# EAGLE design femto-beacon-esp32-lps (EAGLE 9.3.0)

## Sheet 1 of 4
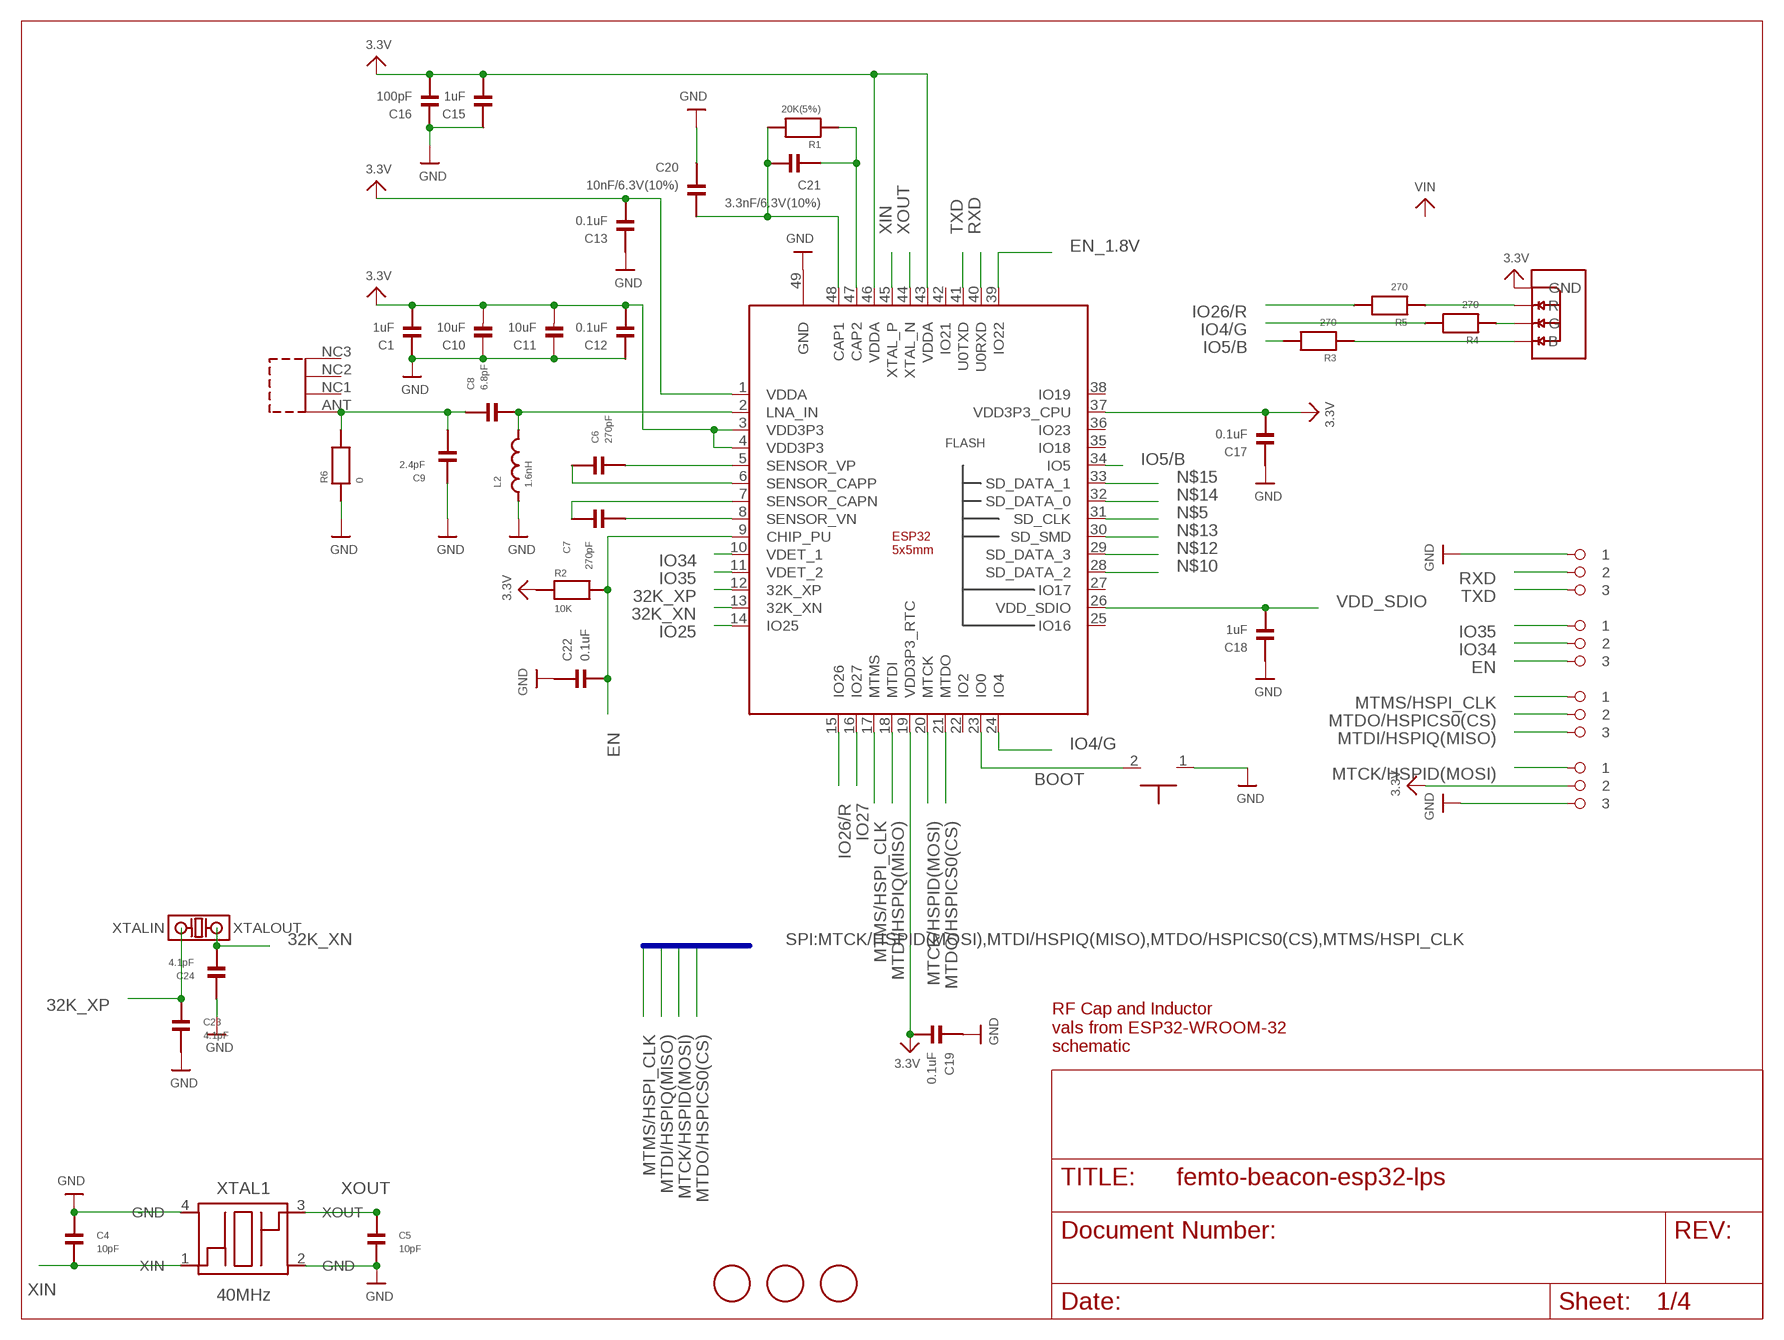
[diagram p0: schematic, sheet 1]

### Parts
ANT1  0479480001  [0479480001]
BOOT1  TACTILE_SWITCH_NO_GND_NO_BOSS  [SIDE_ACT_NO_GND_NO_BOSS]
C1  1uF  CAPACITOR_0201  [PART]
C4  10pF  CAPACITOR_0201  [PART]
C5  10pF  CAPACITOR_0201  [PART]
C6  270pF  CAPACITOR_0201  [PART]
C7  270pF  CAPACITOR_0201  [PART]
C8  6.8pF  CAPACITOR_0201  [PART]
C9  2.4pF  CAPACITOR_0201  [PART]
C10  10uF  CAP_CERAMIC_0603MP  [_0603MP]
C11  10uF  CAP_CERAMIC_0603MP  [_0603MP]
C12  0.1uF  CAPACITOR_0201  [PART]
C13  0.1uF  CAPACITOR_0201  [PART]
C15  1uF  CAPACITOR_0201  [PART]
C16  100pF  CAPACITOR_0201  [PART]
C17  0.1uF  CAPACITOR_0201  [PART]
C18  1uF  CAPACITOR_0201  [PART]
C19  0.1uF  CAPACITOR_0201  [PART]
C20  10nF/6.3V(10%)  CAPACITOR_0201  [PART]
C21  3.3nF/6.3V(10%)  CAPACITOR_0201  [PART]
C22  0.1uF  CAPACITOR_0201  [PART]
C23  4.1pF  CAPACITOR_0201  [PART]
C24  4.1pF  CAPACITOR_0201  [PART]
FID1  FIDUCIAL  [FIDUCIAL_1MM]
FID2  FIDUCIAL  [FIDUCIAL_1MM]
FID3  FIDUCIAL  [FIDUCIAL_1MM]
IC1  ESP32-QFN_5X5  [ESP32-QFN48_5X5]
L2  1.6nH  INDUCTOR_FIXED_0201  [PART]
PIN_EN  1X3_ROUND  [1X3_ROUND]
PIN_GPIO_A  1X3_ROUND  [1X3_ROUND]
PIN_GPIO_B  1X3_ROUND  [1X3_ROUND]
PIN_UART  1X3_ROUND  [1X3_ROUND]
R1  20K(5%)  RESISTOR_0201  [PART]
R2  10K  RESISTOR_0201  [PART]
R3  270  RESISTOR_0201  [PART]
R4  270  RESISTOR_0201  [PART]
R5  270  RESISTOR_0201  [PART]
R6  0  RESISTOR_0201  [PART]
RGB1  LRTB_R48G  [LRTB_R48G]
XTAL1  40MHz  FA-128  [FA-128]
XTAL2  ABS06-107-32.768KHZ-T  [ABS06-107-32.768KHZ-T]

### Nets
3.3V: C1.2 C10.2 C11.2 C12.2 C13.2 C15.2 C16.2 C17.2 C19.2 IC1.1(VDDA) IC1.3(VDD3P3) IC1.4(VDD3P3) IC1.19(VDD3P3_RTC) IC1.37(VDD3P3_CPU) IC1.43(VDDA) IC1.46(VDDA) PIN_GPIO_A.P$2 R2.1 RGB1.1(GND) ; also sheet 2,3,4
32K_XN: C24.1 IC1.13(32K_XN) XTAL2.2(XTALOUT)
32K_XP: C23.2 IC1.12(32K_XP) XTAL2.1(XTALIN)
ANT: C8.2 IC1.2(LNA_IN) L2.2
B_: R3.1 RGB1.4(B)
BOOT: BOOT1.2 IC1.23(IO0)
EN: C22.2 IC1.9(CHIP_PU) PIN_EN.P$3 R2.2
EN_1.8V: IC1.39(IO22)
G_: R4.1 RGB1.3(G)
GND: BOOT1.1 C1.1 C4.1 C5.1 C9.1 C10.1 C11.1 C12.1 C13.1 C15.1 C16.1 C17.1 C18.1 C19.1 C20.1 C22.1 C23.1 C24.2 IC1.49(GND) L2.1 PIN_GPIO_A.P$3 PIN_UART.P$1 R6.1 XTAL1.2(GND) XTAL1.4(GND) ; also sheet 2,3,4
IO4/G: IC1.24(IO4) R4.2
IO5/B: IC1.34(IO5) R3.2
IO25: IC1.14(IO25)
IO26/R: IC1.15(IO26) R5.2
IO27: IC1.16(IO27)
IO34: IC1.10(VDET_1) PIN_EN.P$2
IO35: IC1.11(VDET_2) PIN_EN.P$1
MTCK/HSPID(MOSI): IC1.20(MTCK) PIN_GPIO_A.P$1 ; also sheet 3,4
MTDI/HSPIQ(MISO): IC1.18(MTDI) PIN_GPIO_B.P$3 ; also sheet 3,4
MTDO/HSPICS0(CS): IC1.21(MTDO) PIN_GPIO_B.P$2 ; also sheet 3,4
MTMS/HSPI_CLK: IC1.17(MTMS) PIN_GPIO_B.P$1 ; also sheet 3,4
N$1: C6.1 IC1.5(SENSOR_VP)
N$2: C6.2 IC1.6(SENSOR_CAPP)
N$3: C7.2 IC1.8(SENSOR_VN)
N$4: C7.1 IC1.7(SENSOR_CAPN)
N$5: IC1.31(SD_CLK)
N$6: ANT1.ANT C8.1 C9.2 R6.2
N$7: C21.2 IC1.47(CAP2) R1.1
N$9: C20.2 C21.1 IC1.48(CAP1) R1.2
N$10: IC1.28(SD_DATA_2)
N$12: IC1.29(SD_DATA_3)
N$13: IC1.30(SD_SMD)
N$14: IC1.32(SD_DATA_0)
N$15: IC1.33(SD_DATA_1)
R_: R5.1 RGB1.2(R)
RXD: IC1.40(U0RXD) PIN_UART.P$2
TXD: IC1.41(U0TXD) PIN_UART.P$3
VDD_SDIO: C18.2 IC1.26(VDD_SDIO)
XIN: C4.2 IC1.45(XTAL_P) XTAL1.1(XIN)
XOUT: C5.2 IC1.44(XTAL_N) XTAL1.3(XOUT)
Unconnected: ANT1.NC1 ANT1.NC2 ANT1.NC3 IC1.22(IO2) IC1.25(IO16) IC1.27(IO17) IC1.35(IO18) IC1.36(IO23) IC1.38(IO19) IC1.42(IO21)

### Buses
SPI:MTCK/HSPID(MOSI),MTDI/HSPIQ(MISO),MTDO/HSPICS0(CS),MTMS/HSPI_CLK

### Notes on the sheet
- RF Cap and Inductor
  vals from ESP32-WROOM-32
  schematic

## Sheet 2 of 4
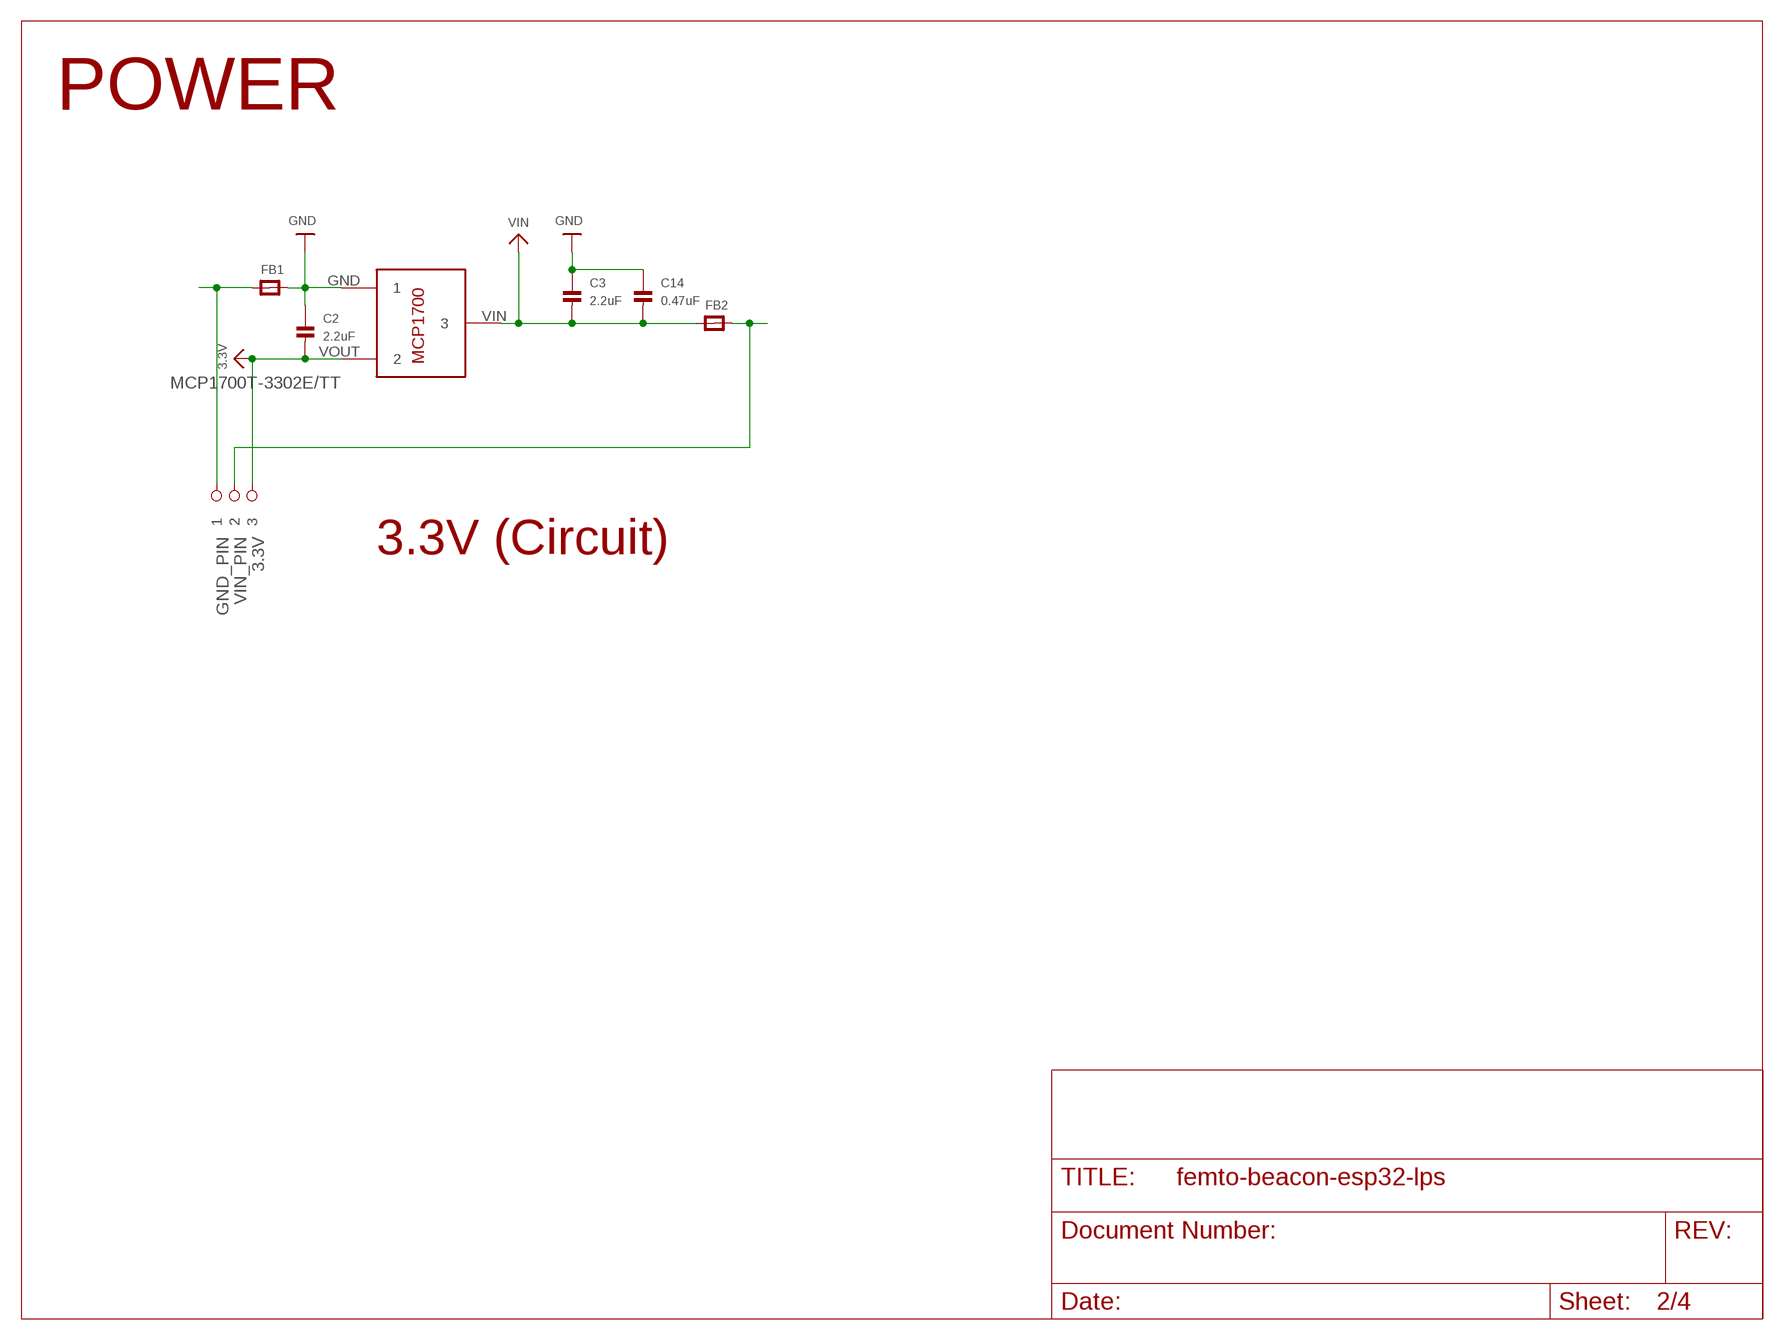
[diagram p1: schematic, sheet 2]

### Parts
C2  2.2uF  CAP_CERAMIC_0402MP  [_0402MP]
C3  2.2uF  CAP_CERAMIC_0402MP  [_0402MP]
C14  0.47uF  CAP_CERAMIC_0402MP  [_0402MP]
FB1  FERRITE_0603MP  [_0603MP]
FB2  FERRITE_0603MP  [_0603MP]
LDO1  MCP1700T-3302E/TT  [MCP1700T-3302E/TT]
PIN_PWR  1X3_ROUND  [1X3_ROUND]

### Nets
3.3V: C2.2 LDO1.VOUT PIN_PWR.P$3 ; also sheet 1,3,4
GND: C2.1 C3.1 C14.1 FB1.2 LDO1.GND ; also sheet 1,3,4
GND_PIN: FB1.1 PIN_PWR.P$1
VIN: C3.2 C14.2 FB2.1 LDO1.VIN
VIN_PIN: FB2.2 PIN_PWR.P$2

### Notes on the sheet
- POWER
- 3.3V (Circuit)

## Sheet 3 of 4
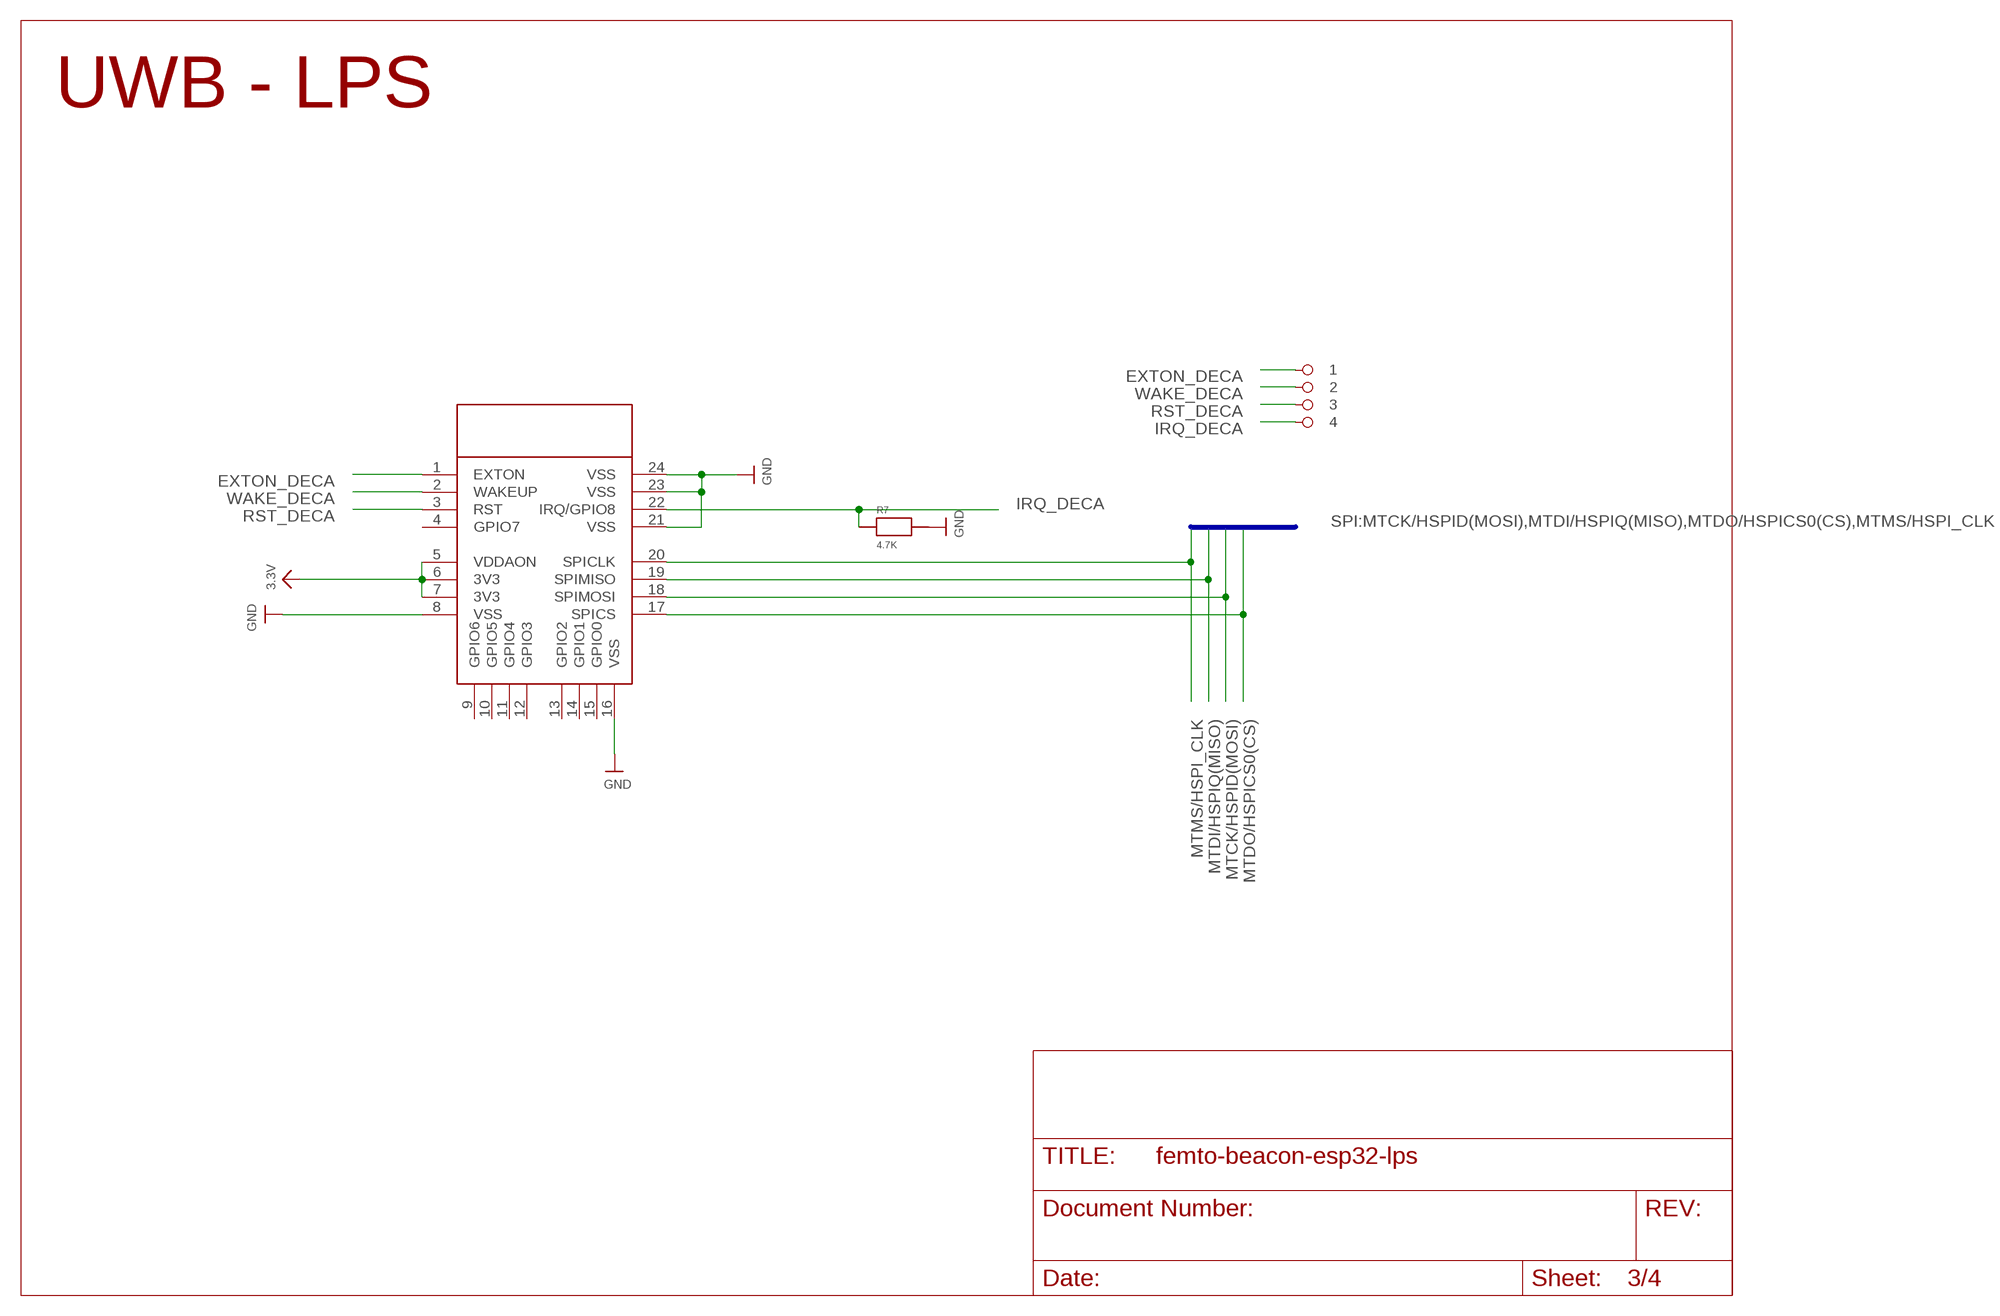
[diagram p2: schematic, sheet 3]

### Parts
LPS1  DWM100  [DWM100_MOD]
R7  4.7K  RESISTOR_0201  [PART]
U$39  1X4_ROUND  [1X4_ROUND]

### Nets
3.3V: LPS1.5(VDDAON) LPS1.6(3V3) LPS1.7(3V3) ; also sheet 1,2,4
EXTON_DECA: LPS1.1(EXTON) U$39.P$1
GND: LPS1.8(VSS) LPS1.16(VSS) LPS1.21(VSS) LPS1.23(VSS) LPS1.24(VSS) R7.2 ; also sheet 1,2,4
IRQ_DECA: LPS1.22(IRQ/GPIO8) R7.1 U$39.P$4
MTCK/HSPID(MOSI): LPS1.18(SPIMOSI) ; also sheet 1,4
MTDI/HSPIQ(MISO): LPS1.19(SPIMISO) ; also sheet 1,4
MTDO/HSPICS0(CS): LPS1.17(SPICS) ; also sheet 1,4
MTMS/HSPI_CLK: LPS1.20(SPICLK) ; also sheet 1,4
RST_DECA: LPS1.3(RST) U$39.P$3
WAKE_DECA: LPS1.2(WAKEUP) U$39.P$2
Unconnected: LPS1.4(GPIO7) LPS1.9(GPIO6) LPS1.10(GPIO5) LPS1.11(GPIO4) LPS1.12(GPIO3) LPS1.13(GPIO2) LPS1.14(GPIO1) LPS1.15(GPIO0)

### Buses
SPI:MTCK/HSPID(MOSI),MTDI/HSPIQ(MISO),MTDO/HSPICS0(CS),MTMS/HSPI_CLK

### Notes on the sheet
- UWB - LPS

## Sheet 4 of 4
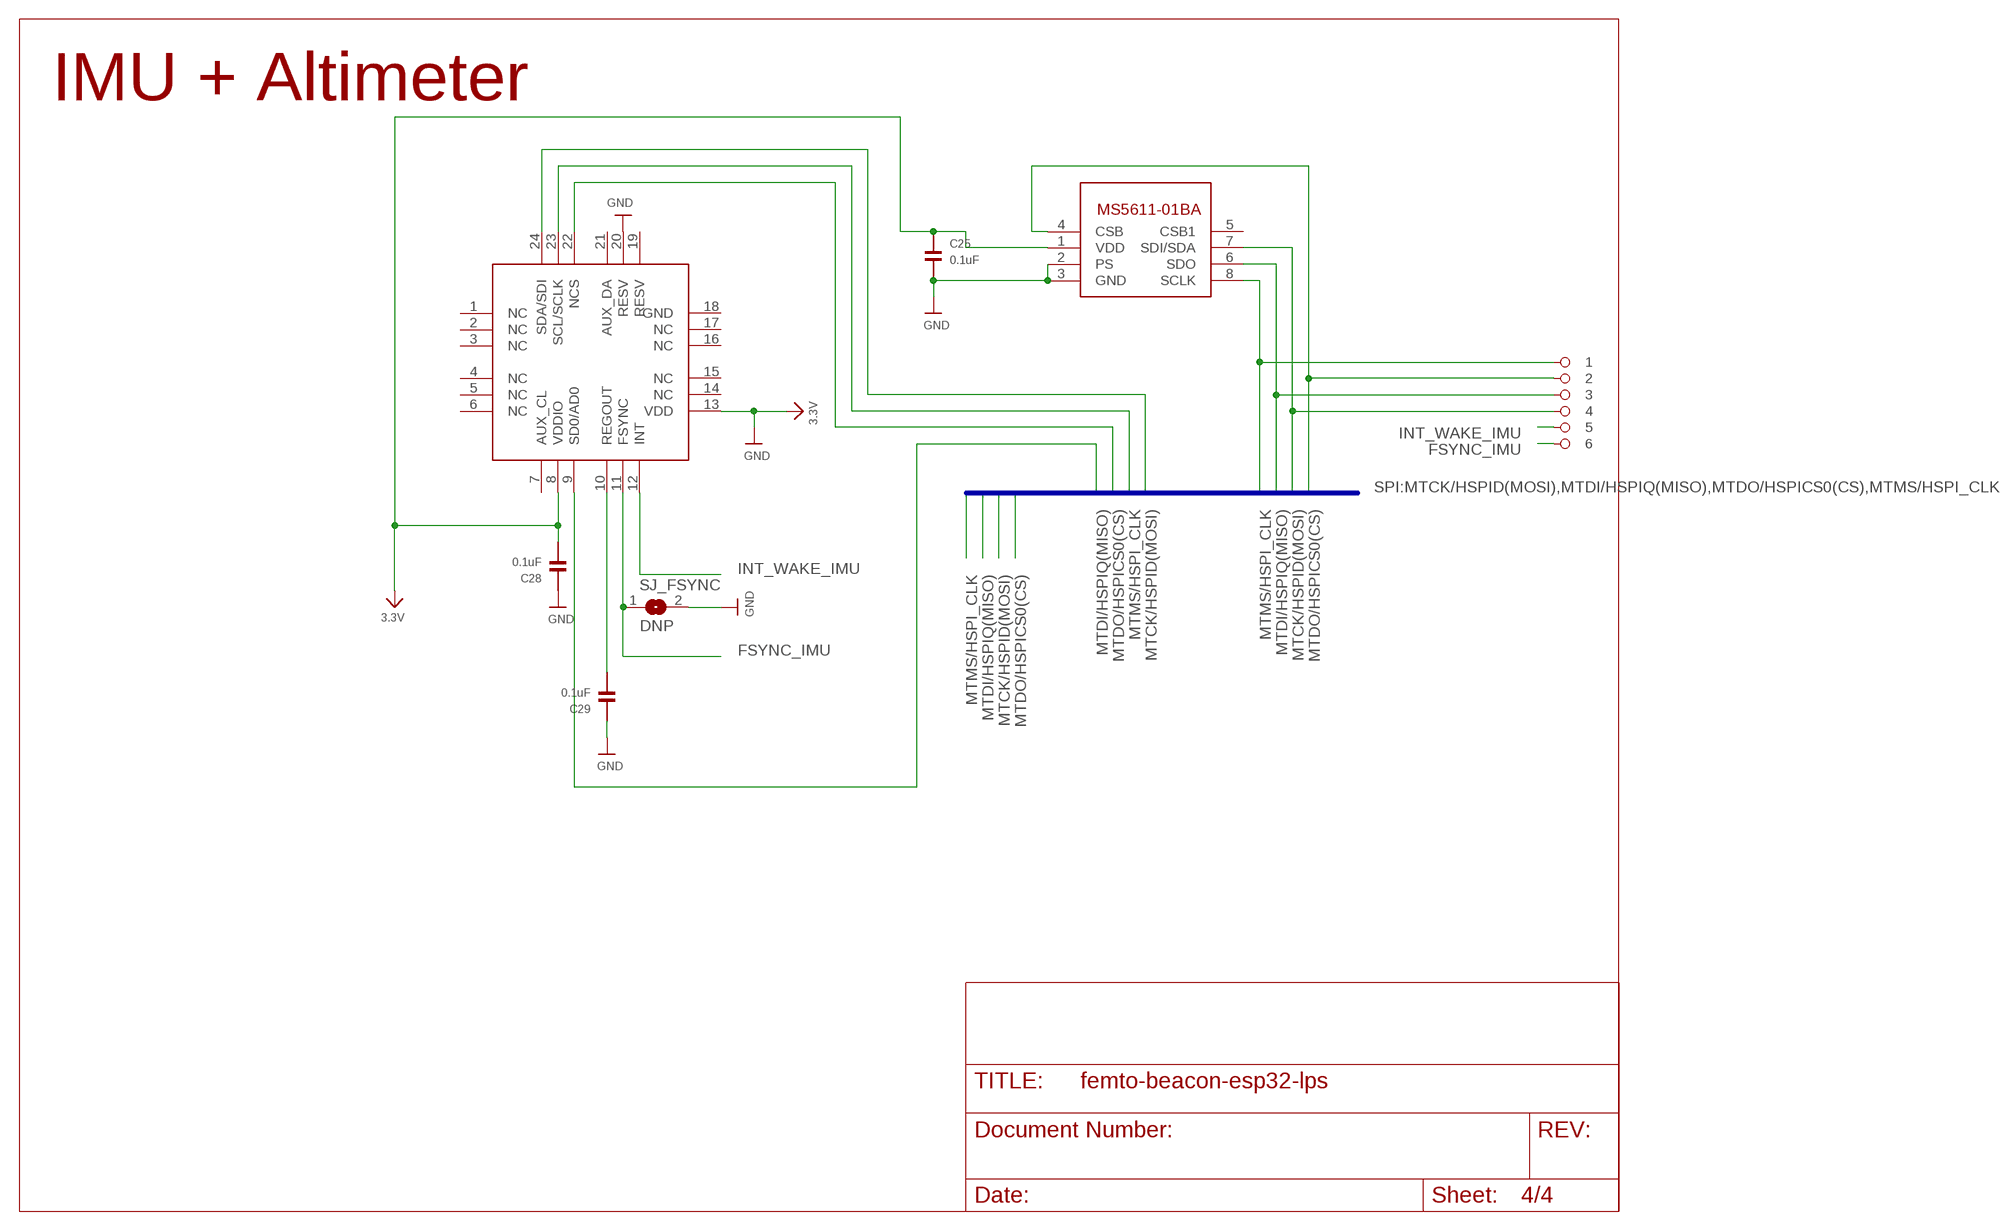
[diagram p3: schematic, sheet 4]

### Parts
ALT1  MS5611-01BA03  [MS5611-01BA03]
C25  0.1uF  CAPACITOR_0201  [PART]
C28  0.1uF  CAPACITOR_0201  [PART]
C29  0.1uF  CAPACITOR_0201  [PART]
IMU1  ICM-20948  [QFN24_3X3]
PIN_IMU_SPI  1X6_ROUND  [1X6_ROUND]
SJ_FSYNC  DNP  SOLDERJUMPERCLOSED  [SOLDERJUMPER_CLOSEDWIRE]

### Nets
3.3V: ALT1.1(VDD) C25.1 C28.2 IMU1.8(VDDIO) IMU1.13(VDD) ; supply symbol labelled GND ; also sheet 1,2,3
FSYNC_IMU: IMU1.11(FSYNC) PIN_IMU_SPI.P$6 SJ_FSYNC.1
GND: ALT1.2(PS) ALT1.3(GND) C25.2 C28.1 C29.1 IMU1.20(RESV) SJ_FSYNC.2 ; also sheet 1,2,3
INT_WAKE_IMU: IMU1.12(INT) PIN_IMU_SPI.P$5
MTCK/HSPID(MOSI): ALT1.7(SDI/SDA) IMU1.24(SDA/SDI) PIN_IMU_SPI.P$4 ; also sheet 1,3
MTDI/HSPIQ(MISO): ALT1.6(SDO) IMU1.9(SD0/AD0) PIN_IMU_SPI.P$3 ; also sheet 1,3
MTDO/HSPICS0(CS): ALT1.4(CSB) IMU1.22(NCS) PIN_IMU_SPI.P$2 ; also sheet 1,3
MTMS/HSPI_CLK: ALT1.8(SCLK) IMU1.23(SCL/SCLK) PIN_IMU_SPI.P$1 ; also sheet 1,3
N$16: C29.2 IMU1.10(REGOUT)
Unconnected: ALT1.5(CSB1) IMU1.1(NC) IMU1.2(NC) IMU1.3(NC) IMU1.4(NC) IMU1.5(NC) IMU1.6(NC) IMU1.7(AUX_CL) IMU1.14(NC) IMU1.15(NC) IMU1.16(NC) IMU1.17(NC) IMU1.19(RESV) IMU1.21(AUX_DA)

### Buses
SPI:MTCK/HSPID(MOSI),MTDI/HSPIQ(MISO),MTDO/HSPICS0(CS),MTMS/HSPI_CLK

### Notes on the sheet
- IMU + Altimeter

## Power pins joined to a net without a drawn wire
GND: IMU1.18(GND)

## Library data of the parts
ALT1 = freeimu:MS5611-01BA03; MPN: MS561101BA03-50
ANT1 = molex-antenna-2.4GHz:0479480001: Molex 2.4GHz SMD tower antenna.; MPN: 0479480001
BOOT1 = omron_tactile_switch:TACTILE_SWITCH_NO_GND_NO_BOSS: Omron tactile switch; MPN: B3U-3000P
C1 C15 C18 = parts_0201:CAPACITOR_0201; MPN: CL03A105KQ3CSNH
C2 C3 = microbuilder:CAP_CERAMIC: Ceramic Capacitors 0402 - 0402 Surface Mount Capacitors 16pF 50V 5% [Digikey: 445-4899-2-ND] 18pF 50V 5% [Digikey: 490-1281-2-ND] 22pF 50V 5% [Digikey: 490-1283-2-ND] 68pF 50V 5% [Digikey: 490-1289-2-ND] 0.1uF 10V 10% [Digikey: 490-1318-2-ND] 1.0uF 6.3V 10% [Digikey: 490-1320-2-ND] 0603 - 0603 Surface Mount Capacitors 16 pF 50V 5% [Digikey: 445-5051-2-ND] 22 pF 50V [Digikey: PCC220ACVTR-ND] 33 pF 50V 5% [Digikey: 490-1415-1-ND] 56pF 50V 5% [Digikey: 490-1421-1-ND] 220pF 50V 5% [Digikey: 445-1285-1-ND] 680 pF 50V 2200 pF 50V 5% C0G [Digikey: 445-1297-1-ND] 5600 pF 100V 5% X7R [Digikey: 478-3711-1-ND] 0.1 µF 25V 10% [Digikey: PCC2277TR-ND] 0.22 µF 16V 10% X7R [Digikey: 445-1318-1-ND] 1.0 µF 25V 10% [Digikey: 445-5146-2-ND] 0603 - RF Specific 3pF 250V +/-0.1pF RF [Digikey: 712-1347-1-ND] 18 pF 250V 5% [Digikey: 478-3505-1-ND or 712-1322-1-ND] 56 pF 250V 5% C0G RF [Digikey: 490-4867-1-ND] 68 pF 250V RF [Digikey: 490-4868-1-ND] 0805 - 0805 Surface Mount Capacitors 220 pF 250V 2% RF Ceramic Capacitor [Digikey: 712-1398-1-ND] 1000 pF 50V 2% NP0 Ceramic Capacitor [Digikey: 478-3760-1-ND] 0.1 µF 25V 10% Ceramic Capacitor [Digikey: PCC1828TR-ND] 1.0 µF 16V 10% Ceramic Capacitor[Digikey: 490-1691-2-ND] 10.0 µF 10V 10% Ceramic Capacitor[Digikey: 709-1228-1-ND] 10.0 uF 16V 10% Ceramic Capacitor [Digikey: 478-5165-2-ND] 47 uF 6.3V 20% Ceramic Capacitor [Digikey: 587-1779-1-ND or 399-5506-1-ND] 1206 - 1206 Surface Mount Capacitors 47uF 10V 20% Ceramic Capacitor [Digikey: 490-5528-1-ND or 399-5508-1-ND or 445-6010-1-ND] 100uF 6.3V -20%, +80% Y5V Ceramic Capacitor (Digikey: 490-4512-1-ND, Mouser: 81-GRM31CF50J107ZE1L); MPN: C1005X5R0J225K050BC
C4 C5 = parts_0201:CAPACITOR_0201; MPN: 02013A100JAT2A
C6 C7 = parts_0201:CAPACITOR_0201; MPN: GRM033R71C271KA01D
C8 = parts_0201:CAPACITOR_0201; MPN: GRM0335C2A6R8DA01D
C9 = parts_0201:CAPACITOR_0201; MPN: GRM0335C1H2R4CA01D
C10 C11 = microbuilder:CAP_CERAMIC: Ceramic Capacitors 0402 - 0402 Surface Mount Capacitors 16pF 50V 5% [Digikey: 445-4899-2-ND] 18pF 50V 5% [Digikey: 490-1281-2-ND] 22pF 50V 5% [Digikey: 490-1283-2-ND] 68pF 50V 5% [Digikey: 490-1289-2-ND] 0.1uF 10V 10% [Digikey: 490-1318-2-ND] 1.0uF 6.3V 10% [Digikey: 490-1320-2-ND] 0603 - 0603 Surface Mount Capacitors 16 pF 50V 5% [Digikey: 445-5051-2-ND] 22 pF 50V [Digikey: PCC220ACVTR-ND] 33 pF 50V 5% [Digikey: 490-1415-1-ND] 56pF 50V 5% [Digikey: 490-1421-1-ND] 220pF 50V 5% [Digikey: 445-1285-1-ND] 680 pF 50V 2200 pF 50V 5% C0G [Digikey: 445-1297-1-ND] 5600 pF 100V 5% X7R [Digikey: 478-3711-1-ND] 0.1 µF 25V 10% [Digikey: PCC2277TR-ND] 0.22 µF 16V 10% X7R [Digikey: 445-1318-1-ND] 1.0 µF 25V 10% [Digikey: 445-5146-2-ND] 0603 - RF Specific 3pF 250V +/-0.1pF RF [Digikey: 712-1347-1-ND] 18 pF 250V 5% [Digikey: 478-3505-1-ND or 712-1322-1-ND] 56 pF 250V 5% C0G RF [Digikey: 490-4867-1-ND] 68 pF 250V RF [Digikey: 490-4868-1-ND] 0805 - 0805 Surface Mount Capacitors 220 pF 250V 2% RF Ceramic Capacitor [Digikey: 712-1398-1-ND] 1000 pF 50V 2% NP0 Ceramic Capacitor [Digikey: 478-3760-1-ND] 0.1 µF 25V 10% Ceramic Capacitor [Digikey: PCC1828TR-ND] 1.0 µF 16V 10% Ceramic Capacitor[Digikey: 490-1691-2-ND] 10.0 µF 10V 10% Ceramic Capacitor[Digikey: 709-1228-1-ND] 10.0 uF 16V 10% Ceramic Capacitor [Digikey: 478-5165-2-ND] 47 uF 6.3V 20% Ceramic Capacitor [Digikey: 587-1779-1-ND or 399-5506-1-ND] 1206 - 1206 Surface Mount Capacitors 47uF 10V 20% Ceramic Capacitor [Digikey: 490-5528-1-ND or 399-5508-1-ND or 445-6010-1-ND] 100uF 6.3V -20%, +80% Y5V Ceramic Capacitor (Digikey: 490-4512-1-ND, Mouser: 81-GRM31CF50J107ZE1L); MPN: GRM188R61C106KAALD
C12 C13 C17 C19 C22 C25 C28 C29 = parts_0201:CAPACITOR_0201; MPN: CC0402KRX7R6BB104
C14 = microbuilder:CAP_CERAMIC: Ceramic Capacitors 0402 - 0402 Surface Mount Capacitors 16pF 50V 5% [Digikey: 445-4899-2-ND] 18pF 50V 5% [Digikey: 490-1281-2-ND] 22pF 50V 5% [Digikey: 490-1283-2-ND] 68pF 50V 5% [Digikey: 490-1289-2-ND] 0.1uF 10V 10% [Digikey: 490-1318-2-ND] 1.0uF 6.3V 10% [Digikey: 490-1320-2-ND] 0603 - 0603 Surface Mount Capacitors 16 pF 50V 5% [Digikey: 445-5051-2-ND] 22 pF 50V [Digikey: PCC220ACVTR-ND] 33 pF 50V 5% [Digikey: 490-1415-1-ND] 56pF 50V 5% [Digikey: 490-1421-1-ND] 220pF 50V 5% [Digikey: 445-1285-1-ND] 680 pF 50V 2200 pF 50V 5% C0G [Digikey: 445-1297-1-ND] 5600 pF 100V 5% X7R [Digikey: 478-3711-1-ND] 0.1 µF 25V 10% [Digikey: PCC2277TR-ND] 0.22 µF 16V 10% X7R [Digikey: 445-1318-1-ND] 1.0 µF 25V 10% [Digikey: 445-5146-2-ND] 0603 - RF Specific 3pF 250V +/-0.1pF RF [Digikey: 712-1347-1-ND] 18 pF 250V 5% [Digikey: 478-3505-1-ND or 712-1322-1-ND] 56 pF 250V 5% C0G RF [Digikey: 490-4867-1-ND] 68 pF 250V RF [Digikey: 490-4868-1-ND] 0805 - 0805 Surface Mount Capacitors 220 pF 250V 2% RF Ceramic Capacitor [Digikey: 712-1398-1-ND] 1000 pF 50V 2% NP0 Ceramic Capacitor [Digikey: 478-3760-1-ND] 0.1 µF 25V 10% Ceramic Capacitor [Digikey: PCC1828TR-ND] 1.0 µF 16V 10% Ceramic Capacitor[Digikey: 490-1691-2-ND] 10.0 µF 10V 10% Ceramic Capacitor[Digikey: 709-1228-1-ND] 10.0 uF 16V 10% Ceramic Capacitor [Digikey: 478-5165-2-ND] 47 uF 6.3V 20% Ceramic Capacitor [Digikey: 587-1779-1-ND or 399-5506-1-ND] 1206 - 1206 Surface Mount Capacitors 47uF 10V 20% Ceramic Capacitor [Digikey: 490-5528-1-ND or 399-5508-1-ND or 445-6010-1-ND] 100uF 6.3V -20%, +80% Y5V Ceramic Capacitor (Digikey: 490-4512-1-ND, Mouser: 81-GRM31CF50J107ZE1L); MPN: GRM155R60J474KE19D
C16 = parts_0201:CAPACITOR_0201; MPN: 0201YC101KAT2A
C20 = parts_0201:CAPACITOR_0201; MPN: GRM033R70J103KA01D
C21 = parts_0201:CAPACITOR_0201; MPN: GRM033R70J332KA01D
C23 C24 = parts_0201:CAPACITOR_0201; MPN: GRM0335C1H4R1BA01D
FB1 FB2 = microbuilder:FERRITE: Ferrite Bead 0603 MMZ1608B121C - 120 Ohm @ 100MHz, 600mA, 0.15 Ohm DC Resistance - Digikey: 445-2164-1-ND BK1608HW121-T - 120 Ohm, 600mA Ferrite Chip - Digikey: 587-1876-2-ND 0805 HZ0805B272R-10 - 2.7K Ohm @ 100MHz, 200mA, 0.8 Ohm DC Resistance - Digikey: 240-2504-1-ND (see also Murata BLM21BD272SN1L) MMZ2012Y152B - 1.5K Ohm @ 100MHz, 500mA, 0.4 Ohm DC Resistance - Digikey: 445-1560-1-ND - Mainly for high frequency (80-400MHz) MMZ2012R102A - 1K Ohm @ 100MHz, 500mA, 0.3 Ohm DC Resistance - Digikey: 445-1555-2-ND - More general purpose (10-200MHz); MPN: BLM18RK102SN1D
FID1-FID3 = adafruit:FIDUCIAL: For use by pick and place machines to calibrate the vision/machine, 1mm By microbuilder.eu
IC1 = esp32-wroom-32:ESP32-QFN_5X5: ESP32-D2WD - has 2 MiB internal flash ESP32-S0WD - has 0 MiB internal flash (requires external SPI flash); MPN: ESP32‑D2WD
IMU1 = icm-20948:ICM-20948; MPN: ICM-20948
L2 = parts_0201:INDUCTOR_FIXED_0201; MPN: LQP03HQ1N6B02D
LDO1 = MCP1700T-3302E_TT:MCP1700T-3302E/TT: Microchip LDO "MCP1700" in a 3-Pin SOT-23 package. ID: MCP1700T-3302E/TT; MPN: MCP1700T-3302E/TT
LPS1 = decawave:DWM100; MPN: DWM1000
PIN_EN PIN_GPIO_A PIN_GPIO_B PIN_PWR PIN_UART = pins_1.27mm_pitch:1X3_ROUND
PIN_IMU_SPI = pins_1.27mm_pitch:1X6_ROUND
R1 = parts_0201:RESISTOR_0201; MPN: RC0201JR-0720KL
R2 = parts_0201:RESISTOR_0201; MPN: RC0201JR-0710KL
R3-R5 = parts_0201:RESISTOR_0201; MPN: RC0201FR-07270RL
R6 = parts_0201:RESISTOR_0201; MPN: RC0201JR-070RL
R7 = parts_0201:RESISTOR_0201; MPN: RC0201FR-074K7L
RGB1 = osram_opto_LED:LRTB_R48G: OSRAM RGB LED; MPN: LRTB R48G
SJ_FSYNC = microbuilder:SOLDERJUMPER: SMD Solder JUMPER Solder the two pads together to create a connection, or remove the solder to break it. REFLOW - Use this footprint for solder paste and reflow ovens. WAVE - Use this footprint for hand-soldering (larger pads). CLOSED - Has a trace between the two pads to ensure it is closed by default. The trace needs to be cut to disable the jumper, and can be closed again by creating a solder bridge between the two pads.
U$39 = pins_1.27mm_pitch:1X4_ROUND
XTAL1 = crystals:FA-128; MPN: FA-128 40.0000MF10Z-K3
XTAL2 = crystals:ABS06-107-32.768KHZ-T: ABS06-107-32.768kHz-T Crystal Oscillator; MPN: ABS06-107-32.768kHz-T

## Board
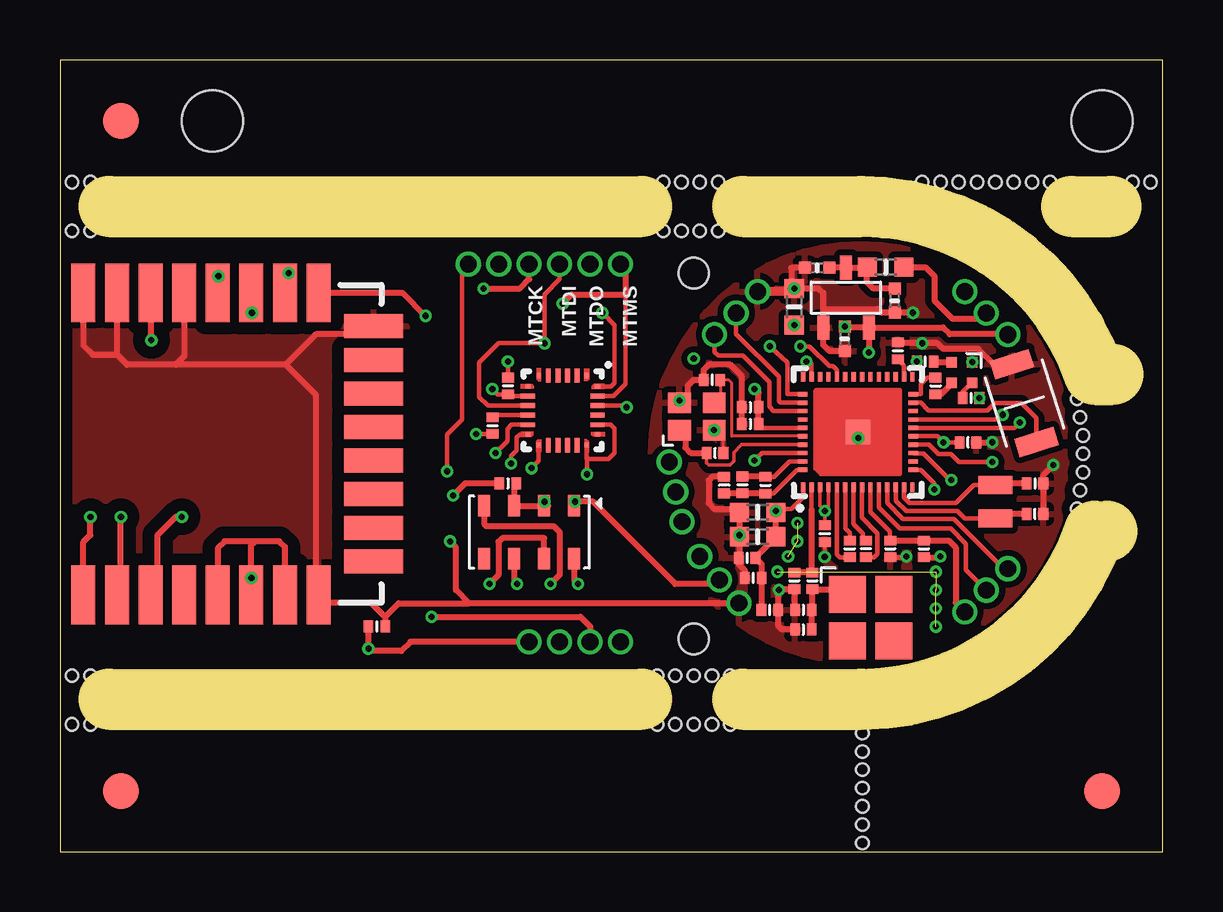
[diagram p4: board, top side]
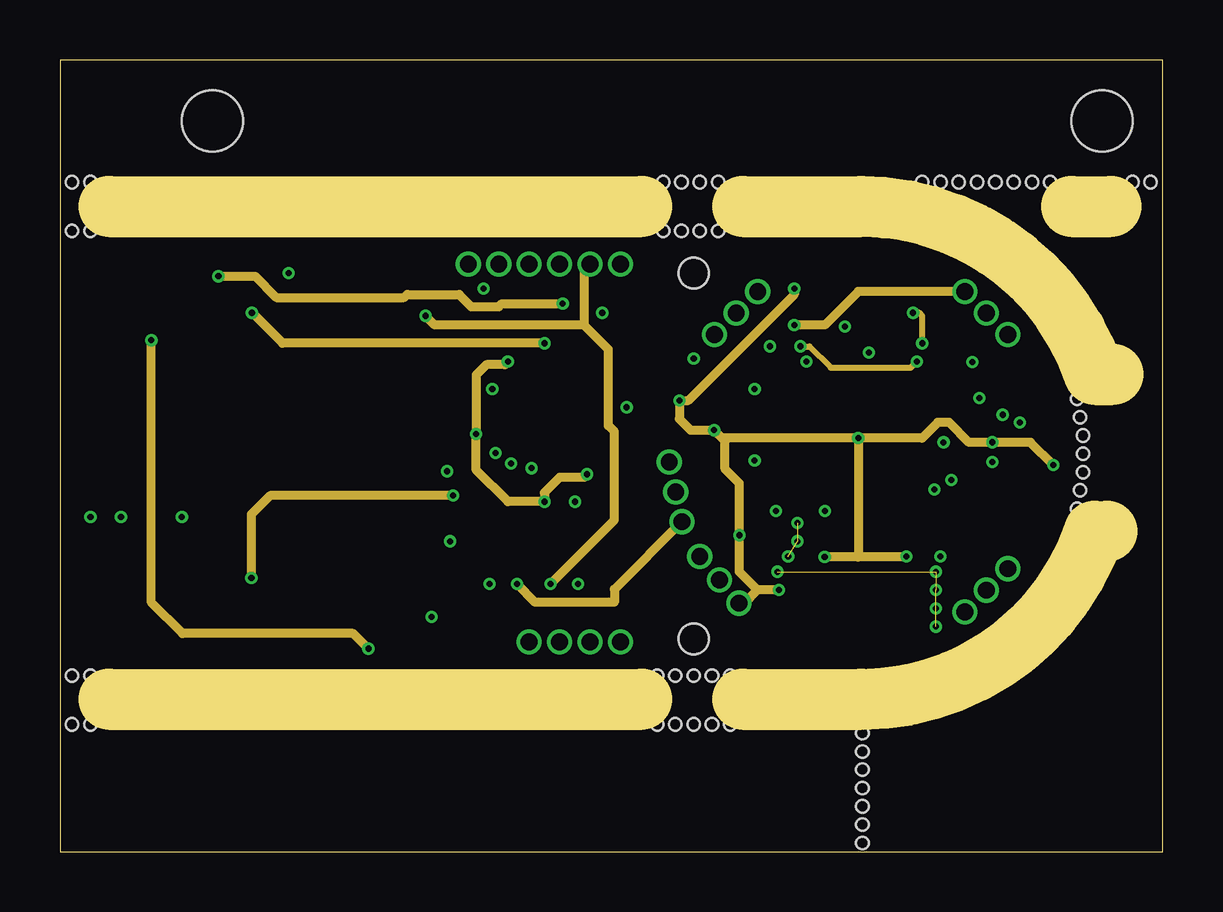
[diagram p5: board, inner layer Route2]
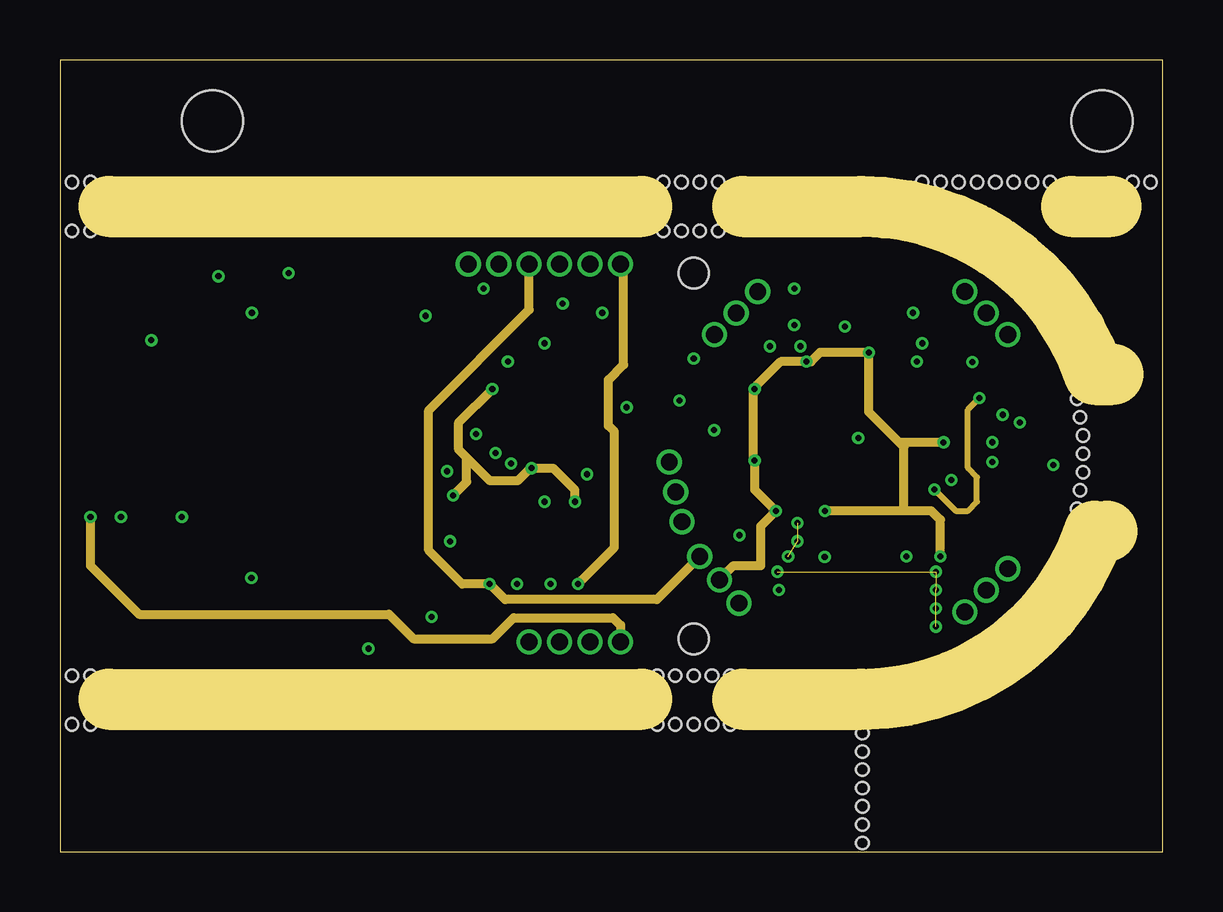
[diagram p6: board, inner layer Route15]
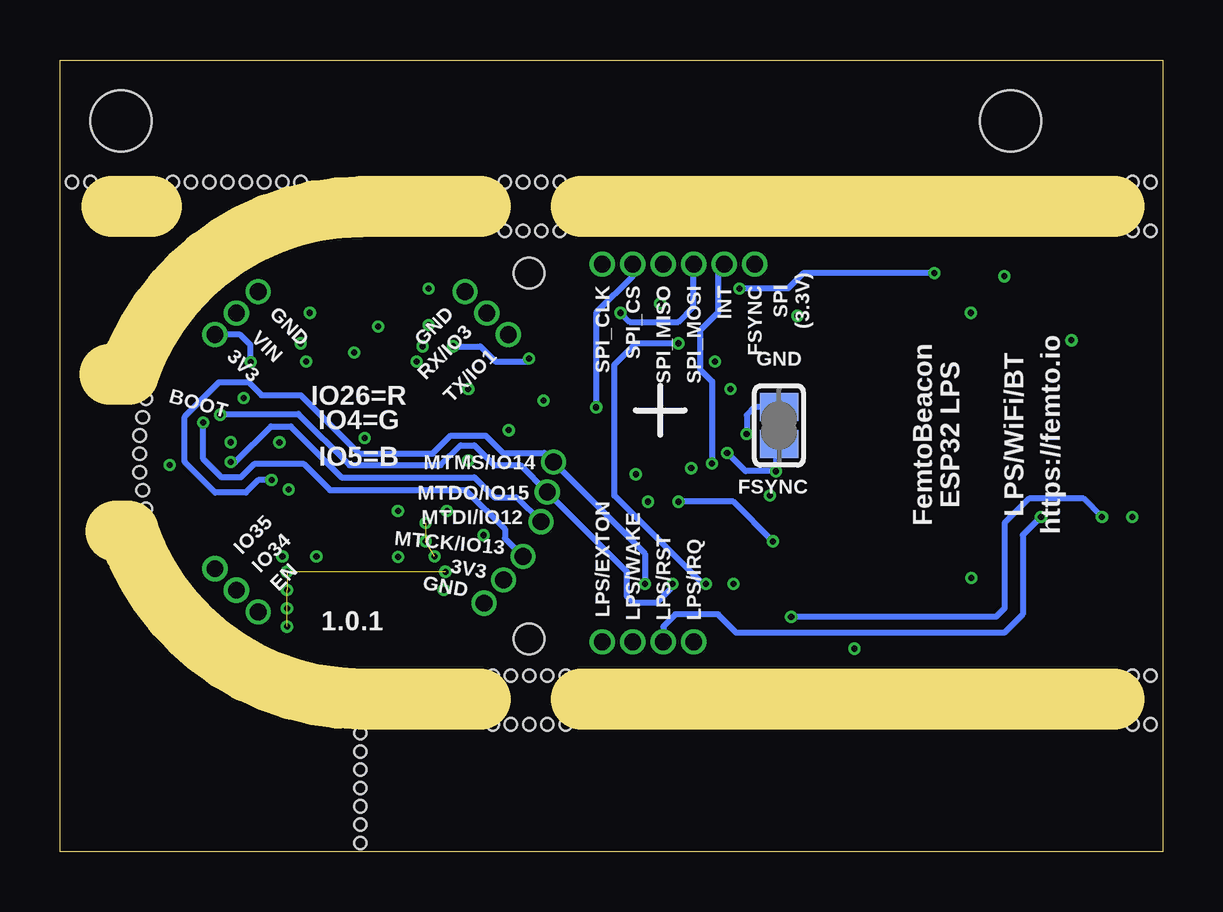
[diagram p7: board, bottom side, seen from below]

Size 45.97 x 33.02 mm. Coordinates in mm from the lower left corner, seen from the top.
Outline: 0,0 45.97,0 45.97,33.02 0,33.02 0,0
Copper layers (1*2*15*16): Top 0.035559375mm / dielectric 0.17018125mm / Route2 0.01778125mm / dielectric 47mil / Route15 0.01778125mm / dielectric 0.17018125mm / Bottom 0.035559375mm
Design rules "oshpark-4layer *": minimum track width 5mil, minimum drill 10mil, track to track 5mil, track to pad 5mil, pad to pad 5mil, via to via 5mil, smd to smd 5mil, copper to edge 15mil, drill to drill 6mil, minimum pad ring 4mil, minimum via ring 4mil, stop-mask expansion 2.5mil, vias tented up to drill 10mil, thermal gap 10mil
Holes 0.51 mm at 42.65,16.6 42.4,18.89 42.65,17.36 42.65,15.84 42.53,18.13 42.4,14.32 42.53,15.08 33.45,0.38 33.45,4.95 1.27,27.93 0.51,27.93 25.15,27.93 25.91,27.93 26.67,27.93 27.43,27.93 45.47,27.93 44.7,27.93 41.27,27.93 40.51,27.93 39.75,27.93 38.99,27.93 33.45,1.14 33.45,1.91 33.45,2.67 33.45,3.43 33.45,4.19 1.27,7.35 0.51,7.35 24.89,7.35 25.65,7.35 26.42,7.35 27.18,7.35 27.94,7.35 1.27,25.9 0.51,25.9 25.15,25.9 25.91,25.9 26.67,25.9 27.43,25.9 1.27,5.32 0.51,5.32 24.89,5.32 25.65,5.32 26.42,5.32 27.18,5.32 27.94,5.32 38.23,27.93 37.47,27.93 36.7,27.93 35.94,27.93
Holes 2.54 mm at 43.43,30.48 6.35,30.48
Holes 1.27 mm at 26.42,8.89 26.42,24.13
Milling: 9 lines

### Footprints (pad centres in the part's own frame; a part is rotated, then mirrored left to right if it is on the bottom)
MS5611-01BA03 = smd 0.9 x 0.5: 1 -1.1,1.875; 2 -1.1,0.625; 3 -1.1,-0.625; 4 -1.1,-1.875; 5 1.1,-1.875; 6 1.1,-0.625; 7 1.1,0.625; 8 1.1,1.875
0479480001 = smd 1.54 x 1.54: ANT -0.963,0.963; NC1 0.978,0.963; NC2 0.978,-0.978; NC3 -0.963,-0.978
SIDE_ACT_NO_GND_NO_BOSS = smd 0.8 x 1.7: 1 -1.7,0; 2 1.7,0
PART = smd 0.4 x 0.5: 1 -0.35,0; 2 0.35,0
_0402MP = smd 0.5 x 0.5: 1 -0.508,0; 2 0.508,0
_0603MP = smd 0.8 x 0.8: 1 -0.762,0; 2 0.762,0
FIDUCIAL_1MM = smd 1.5 x 1.5: 1 0,0
ESP32-QFN48_5X5 = smd 0.18 x 0.4: 1 -2.275,-2.3; 2 -1.925,-2.3; 3 -1.575,-2.3; 4 -1.225,-2.3; 5 -0.875,-2.3; 6 -0.525,-2.3; 7 -0.175,-2.3; 8 0.175,-2.3; 9 0.525,-2.3; 10 0.875,-2.3; 11 1.225,-2.3; 12 1.575,-2.3; 13 1.925,-2.3; 14 2.275,-2.3; 25 2.275,2.3; 26 1.925,2.3; 27 1.575,2.3; 28 1.225,2.3; 29 0.875,2.3; 30 0.525,2.3; 31 0.175,2.3; 32 -0.175,2.3; 33 -0.525,2.3; 34 -0.875,2.3; 35 -1.225,2.3; 36 -1.575,2.3; 37 -1.925,2.3; 38 -2.275,2.3 | smd 0.4 x 0.18: 15 2.3,-1.575; 16 2.3,-1.225; 17 2.3,-0.875; 18 2.3,-0.525; 19 2.3,-0.175; 20 2.3,0.175; 21 2.3,0.525; 22 2.3,0.875; 23 2.3,1.225; 24 2.3,1.575; 39 -2.3,1.575; 40 -2.3,1.225; 41 -2.3,0.875; 42 -2.3,0.525; 43 -2.3,0.175; 44 -2.3,-0.175; 45 -2.3,-0.525; 46 -2.3,-0.875; 47 -2.3,-1.225; 48 -2.3,-1.575 | smd 1 x 1: 49 0,0
QFN24_3X3 = smd 0.2 x 0.2: 1 -1.45,1; 6 -1.45,-1; 7 -1,-1.45; 12 1,-1.45; 13 1.45,-1; 18 1.45,1; 19 1,1.45; 24 -1,1.45 | smd 0.6 x 0.2: 2 -1.45,0.6; 3 -1.45,0.2; 4 -1.45,-0.2; 5 -1.45,-0.6; 14 1.45,-0.6; 15 1.45,-0.2; 16 1.45,0.2; 17 1.45,0.6 | smd 0.2 x 0.6: 8 -0.6,-1.45; 9 -0.2,-1.45; 10 0.2,-1.45; 11 0.6,-1.45; 20 0.6,1.45; 21 0.2,1.45; 22 -0.2,1.45; 23 -0.6,1.45
MCP1700T-3302E/TT = smd 0.5 x 1: GND -0.95,-1.25; VIN 0,1.25; VOUT 0.95,-1.25
DWM100_MOD = smd 2.45 x 1: 1 -6.295,0.8; 2 -6.295,-0.6; 3 -6.295,-2; 4 -6.295,-3.4; 5 -6.295,-4.8; 6 -6.295,-6.2; 7 -6.295,-7.6; 8 -6.295,-9; 17 6.295,-9; 18 6.295,-7.6; 19 6.295,-6.2; 20 6.295,-4.8; 21 6.295,-3.4; 22 6.295,-2; 23 6.295,-0.6; 24 6.295,0.8 | smd 1 x 2.45: 9 -4.9,-11.295; 10 -3.5,-11.295; 11 -2.1,-11.295; 12 -0.7,-11.295; 13 0.7,-11.295; 14 2.1,-11.295; 15 3.5,-11.295; 16 4.9,-11.295
1X3_ROUND = drill 0.7 pad 1: P$1 0,0; P$2 0,-1.27; P$3 0,-2.54
1X6_ROUND = drill 0.7 pad 1: P$1 0,0; P$2 0,-1.27; P$3 0,-2.54; P$4 0,-3.81; P$5 0,-5.08; P$6 0,-6.35
LRTB_R48G = smd 0.45 x 0.45: 1 0.425,0.425; 2 0.425,-0.425; 3 -0.425,-0.425; 4 -0.425,0.425
SOLDERJUMPER_CLOSEDWIRE = smd 1.168 x 1.6: 1 -0.762,0; 2 0.762,0 | smd 0.635 x 0.203: WIRE 0,0
1X4_ROUND = drill 0.7 pad 1: P$1 0,0; P$2 0,-1.27; P$3 0,-2.54; P$4 0,-3.81
FA-128 = smd 0.95 x 0.85: 1 -0.725,-0.575; 2 0.725,-0.575; 3 0.725,0.575; 4 -0.725,0.575
ABS06-107-32.768KHZ-T = smd 0.75 x 1.4: 1 -0.7,0; 2 0.7,0

### Placement (x,y rotation side)
ALT1  19.56,13.34 270 top
ANT1  33.78,9.78 0 top
BOOT1  40.2,18.72 287.5 top
C1  28.64,12.26 0 top
C2  32.72,21.4 90 top
C3  31.56,24.36 0 top
C4  27.3,16.64 180 top
C5  27.18,19.68 0 top
C6  32.92,12.64 90 top
C7  33.59,12.64 270 top
C8  31.37,11.3 90 top
C9  30.99,10.1 0 top
C10  29.08,14.16 0 top
C11  29.08,13.14 0 top
C12  28.89,11.43 0 top
C13  29.59,10.1 180 top
C14  34.8,22.99 90 top
C15  28.77,17.84 0 top
C16  28.77,18.54 0 top
C17  31.88,13.27 90 top
C18  34.92,20.89 270 top
C19  37.85,17.08 180 top
C20  27.69,15.3 270 top
C21  29.4,15.29 90 top
C22  34.61,12.64 90 top
C23  40.64,14.1 180 top
C24  40.64,15.37 0 top
C25  18.67,15.37 0 top
C28  18.67,19.43 270 top
C29  18.03,17.78 90 top
FB1  30.61,22.73 90 top
FB2  34.42,24.38 0 top
FID1  2.54,2.54 0 top
FID2  2.54,30.48 0 top
FID3  43.43,2.54 0 top
IC1  33.26,17.51 0 top
IMU1  20.95,18.41 270 top
L2  30.61,11.3 90 top
LDO1  32.77,23.11 0 top
LPS1  1.78,17.02 90 top
PIN_EN  39.52,11.81 315 top
PIN_GPIO_A  26.67,12.32 40 top
PIN_GPIO_B  25.4,16.26 12 top
PIN_IMU_SPI  23.37,24.51 270 top
PIN_PWR  37.72,23.37 45 top
PIN_UART  29.08,23.37 315 top
R1  28.45,15.3 270 top
R2  36,12.64 90 top
R3  36.07,20.45 180 top
R4  36.5,19.43 90 top
R5  37.97,18.92 0 top
R6  30.99,9.27 0 top
R7  13.21,9.4 0 top
RGB1  37.59,19.99 0 top
SJ_FSYNC  16,17.78 90 bottom
U$39  23.37,8.76 270 top
XTAL1  26.54,18.16 0 top
XTAL2  38.99,14.61 90 top

### Tracks (layer width: path | path; a pad name or v marks a point on that pad's centre or on a via)
3.3V  (via drill 0.25 pad 0.51)
  Top 0.152: IC1.3 31.68,14.43 v31.89,14.22 | C17.2 31.88,14.21 v31.89,14.22 | v31.89,14.22 32.03,14.37 IC1.4
  Top 0.178: IC1.19 36.58,17.33 v36.83,17.08 C19.2 | IC1.46 29.27,16.63 v28.96,16.32 | IC1.43 29.28,17.68 C15.2 | IC1.37 31.33,20.36 31.24,20.45 v31.11,20.45 | C10.2 29.98,14.3 30.48,14.3 30.98,14.8 IC1.1 | IMU1.8 18.73,19.02 C28.2 18.24,19.08 v18.02,19.3 | IMU1.13 19.95,16.3 v19.66,16
  Top 0.254: LDO1.VOUT 32.76,21.86 C2.2 | C13.2 C12.2 29.24,12 C1.2 28.99,12.29 C11.2 C10.2 v29.84,14.22 | C15.2 C16.2 29.12,19.14 v28.96,19.3 | LDO1.VOUT v33.72,20.83 | LDO1.VOUT 36.81,21.86 37.08,21.59 39.5,21.59 PIN_PWR.P$3 | R2.1 36.67,12.29 v36.7,12.32 | C25.1 16.89,15.37 v16.38,14.86 | PIN_GPIO_A.P$2 27.32,11.18 25.65,11.18 22.23,14.61 21.6,14.61 ALT1.1 21.46,14.46 v21.46,14.61 | LPS1.7 9.38,12.72 9.14,12.95 8.13,12.95 | 8.13,12.95 6.86,12.95 6.58,12.67 LPS1.5 | LPS1.6 v7.98,11.43 7.98,12.8 8.13,12.95 | RGB1.1 v38.03,20.43
  Route2 0.381: v16.38,14.86 8.76,14.86 7.98,14.07 v7.98,11.43
  Route15 0.254: v19.66,16 19.63,16.03
  Route15 0.381: 35.18,14.22 36.32,14.22 36.7,13.84 v36.7,12.32 | 35.18,14.22 v31.89,14.22 | v36.83,17.08 34.99,17.08 | 34.99,17.08 33.72,18.35 v33.72,20.83 31.69,20.83 31.3,20.45 v31.11,20.45 30.04,20.45 28.96,19.37 v28.96,19.3 28.89,19.24 28.89,16.38 v28.96,16.32 28.96,15.11 v29.84,14.22 29.21,13.59 29.21,11.94 28.08,11.94 PIN_GPIO_A.P$2 | 34.99,17.08 35.18,16.89 35.18,14.22 | 19.63,16.03 19.07,15.47 17.93,15.47 16.95,16.45 | 16.95,16.45 16.62,16.78 16.62,17.91 v18.02,19.3 | v19.66,16 20.55,16 21.46,15.09 v21.46,14.61 | v16.38,14.86 16.95,15.43 16.95,16.45
  Bottom 0.254: v38.03,20.43 38.03,21.14 38.46,21.57 PIN_PWR.P$3
  other vias: 32.72,21.91
32K_XN
  Top 0.178: IC1.13 35.18,14.78 35.41,14.54 37.34,14.54 38.1,15.3 XTAL2.2
  Top 0.254: C24.1 39.05,15.37 XTAL2.2
32K_XP
  Top 0.178: IC1.12 34.85,15.19 34.85,14.64 35.28,14.21 37.41,14.21 37.72,13.9 XTAL2.1
  Top 0.254: C23.2 39.18,14.1 XTAL2.1
ANT
  Top 0.178: IC1.2 31.33,14.26
  Top 0.254: L2.2 C8.2 31.33,11.69 31.33,14.26
B_
  Top 0.254: RGB1.4 36.45,20.41 R3.1
BOOT
  Top 0.178: BOOT1.2 40.71,18.09 40.08,18.73 38.96,18.73 38.65,18.41 36.2,18.41 35.88,18.73 IC1.23
EN
  Top 0.178: IC1.9 33.78,14.18 34.6,13.36 C22.2
  Top 0.254: C22.2 R2.2 37.05,12.99 37.34,12.7 37.34,10.4 PIN_EN.P$3
EN_1.8V  (via drill 0.25 pad 0.51)
  Top 0.178: IC1.39 30.32,19.08 30.32,20.4 v29.59,21.08
  Bottom 0.254: v29.59,21.08 28.45,21.08 27.81,20.45 26.54,20.45 v26.42,20.57
EXTON_DECA  (via drill 0.25 pad 0.51)
  Top 0.254: LPS1.1 0.98,12.92 1.27,13.21 v1.27,13.97
  Route15 0.381: v1.27,13.97 1.27,11.94 3.3,9.91 13.72,9.91 14.73,8.89 18.03,8.89 18.91,9.77 23.05,9.77 23.37,9.45 U$39.P$1
FSYNC_IMU  (via drill 0.25 pad 0.51)
  Top 0.178: IMU1.11 18.83,17.82 18.65,17.64 18.65,17.13 v18.16,16.64 | PIN_IMU_SPI.P$6 16.76,24.26 16.76,18.03 16.13,17.4 v16.13,15.88
  Bottom 0.254: v18.16,16.64 17.4,15.88 v16.13,15.88 16.13,16.89 SJ_FSYNC.1
G_
  Top 0.254: R4.1 36.71,19.08 37.17,19.54 RGB1.3
GND  (via drill 0.25 pad 0.51)
  Top 0.127: v25.82,18.83 XTAL1.4 | C4.1 27.66,17.2 XTAL1.2
  Top 0.152: C17.1 v31.88,12.3
  Top 0.178: C22.1 35.25,12.29 v35.28,12.32 | IMU1.18 21.95,16.51 | 21.95,16.51 21.95,16.4 21.97,16.38 22.86,16.38 23.11,16.64 23.11,17.65 22.95,17.82 IMU1.20 | C29.1 v17.35,17.43 v17.35,17.42 | C28.1 v18.67,20.45 | 21.95,16.51 21.97,16.49 v21.97,15.75
  Top 0.254: XTAL1.4 26.16,19.08 26.16,19.43 26.42,19.68 C5.1 26.83,20.1 27.05,20.32 27.94,20.32 28.42,19.84 C16.1 C15.1 | C9.1 30.64,10.92 L2.1 30,10.95 v29.97,10.92 29.94,10.89 C13.1 29.94,9.43 30.1,9.27 R6.1 | C2.1 32.07,20.89 31.82,21.14 LDO1.GND 31.82,22.64 | 31.82,22.64 34.08,22.64 34.25,22.48 C14.1 v35.56,22.48 | 31.82,22.64 31.82,23.3 31.62,23.5 30.73,23.5 FB1.2 30.48,23.62 30.48,24.36 C3.1 | C18.1 35.91,21.24 v35.94,21.21 36.58,21.21 36.81,20.97 38.29,20.97 38.92,20.34 BOOT1.1 | C19.1 v38.86,17.08 | C11.1 C10.1 28.19,14.29 27.3,14.29 27.05,14.54 27.05,15.49 27.2,15.65 C20.1 | C12.1 28.54,11.75 28.29,12 C1.1 28.32,12.29 C11.1 | v41.4,16.13 40.99,15.72 C24.2 C23.1 | C11.1 v28.32,13.21 | C25.2 18.93,15.28 ALT1.3 ALT1.2 20.36,14.44 v20.19,14.61 | PIN_GPIO_A.P$3 17.06,10.37 | 17.06,10.37 16.51,10.92 16.51,12.7 v16.26,12.95 | LPS1.21 5.18,20.67 4.83,20.32 | 4.83,20.32 2.79,20.32 2.38,20.74 | 2.38,20.74 LPS1.23 | 13.56,9.81 12.95,10.41 11.09,10.41 LPS1.8 10.67,10.83 10.67,19.05 9.4,20.32 | 13.56,9.81 R7.2 | 13.56,9.81 14.12,10.37 17.06,10.37 | LPS1.16 12.52,21.92 12.19,21.59 10.67,21.59 9.4,20.32 | 9.4,20.32 4.83,20.32 | LPS1.24 0.98,21.12 1.36,20.74 2.38,20.74
  Top 0.381: IC1.49 33.26,17.89 v33.27,17.25 | 30.73,23.5 30.61,23.37 PIN_UART.P$1
  Route2 0.254: v35.94,21.21 35.94,22.35 35.81,22.48 v35.56,22.48
  Route2 0.381: v33.27,17.25 27.6,17.25 | 27.6,17.25 XTAL1.2 26.29,17.59 25.82,18.06 v25.82,18.83 26.19,18.83 30.61,23.24 FB1.2 | 27.6,17.25 27.73,17.13 27.73,15.96 28.32,15.37 v28.32,13.21 28.32,11.68 29.08,10.92 | v29.97,10.92 29.08,10.92 | v33.27,17.25 35.94,17.25 36.59,17.91 37.07,17.91 37.89,17.08 v38.86,17.08 40.45,17.08 v41.4,16.13 | v35.28,12.32 35.26,12.3 33.27,12.3 | 33.27,12.3 v31.88,12.3 | v33.27,17.25 33.27,12.3 | PIN_GPIO_A.P$3 28.53,10.37 29.08,10.92 | v18.67,20.45 18.54,20.32 17.78,20.32 17.35,19.89 v17.35,17.42 17.35,15.93 18.67,14.61 v20.19,14.61 20.19,14.99 20.83,15.62 21.84,15.62 v21.97,15.75
  Bottom 0.254: SJ_FSYNC.2 17.02,18.54 17.35,18.21 v17.35,17.42 | v20.19,14.61 17.91,14.61 v16.26,12.95
  other vias: 27.27,17.59 30.61,23.5
  pour Top (isolate 0.254): 24.64,16.62 arc-90 33.38,25.37 arc-90 42.13,16.62 arc-90 33.38,7.87 arc-90
  pour Top (isolate 0.508): 0.38,22.48 0.38,11.56 14.48,11.56 14.48,22.48
GND_PIN  (via drill 0.25 pad 0.51)
  Route2 0.381: PIN_PWR.P$1 33.27,23.37 31.88,21.97 FB1.1
  other vias: 30.61,21.97
INT_WAKE_IMU  (via drill 0.25 pad 0.51)
  Top 0.178: IMU1.12 19.18,17.41 19.03,17.27 19.03,16.75 18.8,16.51 v18.8,16.19
  Bottom 0.254: v18.8,16.19 18.8,19.62 19.29,20.11 19.29,21.73 18.54,22.48 18.54,24.26 PIN_IMU_SPI.P$5
IO4/G
  Top 0.178: IC1.24 35.87,19.08 35.88,19.1 35.88,19.51 36.16,19.78 R4.2
IO5/B  (via drill 0.25 pad 0.51)
  Top 0.178: IC1.34 32.38,20.09 32.22,20.25 32.07,20.25 31.24,21.08 v30.86,21.08
  Route2 0.254: v30.86,21.08 31.24,21.08 32.13,20.19 35.46,20.19 R3.2
  other vias: 35.72,20.45
IO26/R  (via drill 0.25 pad 0.51)
  Top 0.178: IC1.15 35.88,15.93 36.45,15.37 v36.45,15.11
  Route15 0.254: v36.45,15.11 37.34,14.22 37.85,14.22 38.23,14.61 38.23,15.62 37.85,16 37.85,18.45 R5.2
  other vias: 38.32,18.92
IO34
  Top 0.178: IC1.10 34.13,14.36 35,13.49 37.13,13.49 37.77,12.85 37.77,11.76 PIN_EN.P$2
IO35
  Top 0.178: IC1.11 34.48,14.54 35.14,13.88 37.27,13.88 39.34,11.81 PIN_EN.P$1
IRQ_DECA  (via drill 0.25 pad 0.51)
  Top 0.254: U$39.P$4 14.61,8.76 14.22,8.38 12.95,8.38 v12.86,8.48 R7.1 | LPS1.22 3.78,21.37 v3.81,21.34
  Route2 0.381: v12.86,8.48 12.22,9.11 5.11,9.11 3.81,10.41 v3.81,21.34
MTCK/HSPID(MOSI)  (via drill 0.25 pad 0.51)
  Top 0.178: IC1.20 39.78,17.68 v40.01,17.91 | IMU1.24 22.97,19.41 23.11,19.56 23.11,21.97 v22.61,22.48
  Top 0.254: ALT1.7 20.18,13.09 18.44,13.09 18.28,12.93 18.28,11.54 v17.91,11.18 | LPS1.18 9.38,23.98 v9.53,24.13 | v17.65,23.5 19.18,23.5 19.56,23.88 PIN_IMU_SPI.P$4
  Route15 0.381: PIN_IMU_SPI.P$4 19.56,22.61 15.37,18.41 15.37,12.57 16.76,11.18 v17.91,11.18 18.55,10.53 24.88,10.53 PIN_GPIO_A.P$1
  Bottom 0.254: v40.01,17.91 40.01,16.38 39.24,15.62 38.43,15.62 37.89,16.17 35.79,16.17 34.72,15.09 29.06,15.09 27.43,13.46 27.43,13.08 PIN_GPIO_A.P$1 | v22.61,22.48 22.23,22.1 20.19,22.1 19.56,22.73 PIN_IMU_SPI.P$4 | v9.53,24.13 14.99,24.13 15.62,23.5 v17.65,23.5
MTDI/HSPIQ(MISO)  (via drill 0.25 pad 0.51)
  Top 0.178: IC1.18 36.23,16.98 36.62,16.59 37.14,16.59 37.47,16.26 v38.86,16.26 | IMU1.9 17.83,18.61 17.48,18.97 17.48,20.4 18.29,21.21 v20.19,21.21 20.19,23.24 20.83,23.88 PIN_IMU_SPI.P$3
  Top 0.254: ALT1.6 18.93,11.29 v19.05,11.18 | LPS1.19 7.98,22.5 v8,22.48
  Route2 0.381: PIN_GPIO_B.P$3 23.11,10.96 23.11,10.41 19.81,10.41 v19.05,11.18 | v8,22.48 9.27,21.21 v20.19,21.21
  Bottom 0.254: v38.86,16.26 38.66,16.26 37.18,17.74 36.35,17.74 34.24,15.62 28.7,15.62 27.87,14.79 26.94,14.79 PIN_GPIO_B.P$3 | v19.05,11.18 19.18,11.18 22.86,14.86 22.86,20.32 21.97,21.21 v20.19,21.21
MTDO/HSPICS0(CS)  (via drill 0.25 pad 0.51)
  Top 0.178: IC1.21 39.1,18.03 v39.29,18.23 | IMU1.22 23.55,18.61 v23.62,18.54
  Top 0.254: ALT1.4 17.68,13.69 17.78,13.59 20.57,13.59 20.83,13.34 20.83,11.56 v20.45,11.18 | LPS1.17 14.28,23.31 v15.24,22.35
  Route2 0.381: v20.45,11.18 23.11,13.84 23.11,17.53 22.86,17.78 22.86,20.95 21.84,21.97 | PIN_IMU_SPI.P$2 21.84,24.26 21.84,21.97 | 21.84,21.97 15.62,21.97 v15.24,22.35
  Bottom 0.254: v39.29,18.23 39.26,18.26 36.04,18.26 33.91,16.13 30.1,16.13 29.27,16.95 28.7,16.95 27.88,16.13 26.78,16.13 PIN_GPIO_B.P$2 22.35,11.7 22.35,10.67 22.1,10.41 21.08,10.41 20.45,11.05 v20.45,11.18 | v23.62,18.54 23.62,22.48 22.1,24 PIN_IMU_SPI.P$2
MTMS/HSPI_CLK  (via drill 0.25 pad 0.51)
  Top 0.178: v37.16,15.51 37.09,15.51 35.98,16.61 35.58,16.61 IC1.17 | IMU1.23 23.08,19.02 23.57,19.51 23.57,23.24
  Top 0.254: PIN_IMU_SPI.P$1 23.57,24.31 23.57,23.24 21.34,23.24 v20.95,22.86 | ALT1.8 21.43,11.33 v21.59,11.18 | LPS1.20 6.73,23.16 6.73,22.73 6.6,22.86 v6.6,24
  Route2 0.381: v6.6,24 8.13,24 9.02,23.11 14.35,23.11 14.48,23.24 16.64,23.24 17.14,22.73 18.29,22.73 18.41,22.86 v20.95,22.86
  Route15 0.381: v21.59,11.18 23.11,12.7 23.11,17.53 22.86,17.78 22.86,19.68 23.5,20.32 23.5,24.38 PIN_IMU_SPI.P$1
  Bottom 0.254: v37.16,15.51 37.71,15.51 38.23,14.99 39.5,14.99 40.77,16.26 40.77,18.16 39.34,19.58 38.1,19.58 37.57,19.05 35.93,19.05 33.49,16.61 30.43,16.61 29.68,17.36 28.23,17.36 27.5,16.64 25.78,16.64 PIN_GPIO_B.P$1 21.59,12.45 v21.59,11.18
N$1
  Top 0.178: C6.1 32.51,12.29 32.38,12.41 IC1.5
N$2
  Top 0.178: IC1.6 32.73,13.49 32.92,13.3 C6.2
N$3
  Top 0.178: IC1.8 33.43,13.94 34.08,13.29 34.08,12.43 33.94,12.29 C7.2
N$4
  Top 0.178: IC1.7 33.08,13.68 33.47,13.29 33.47,13.11 C7.1
N$6
  Top 0.254: ANT1.ANT 32.61,10.95 C8.1 31.37,10.13 C9.2 R6.2
N$7
  Top 0.178: IC1.47 30.41,16.28 29.77,15.64 C21.2
  Top 0.254: C21.2 29.39,15.65 R1.1
N$8  (via drill 0.25 pad 0.51)  (2 unrouted)
  other vias: 30.35,12.32 30.73,12.95 30.73,13.72
N$9
  Top 0.178: IC1.48 30.73,15.93 29.73,14.94 C21.1
  Top 0.254: C21.1 29.39,14.95 R1.2 C20.2
N$11  (via drill 0.25 pad 0.51)  (4 unrouted)
  other vias: 29.91,11.68 36.51,10.92 36.51,10.16 36.51,9.4 36.51,11.68
N$16
  Top 0.178: IMU1.10 18.12,18.21 C29.2
R_
  Top 0.178: RGB1.2 37.62,19.17 R5.1
RST_DECA  (via drill 0.25 pad 0.51)
  Top 0.254: LPS1.3 4.06,11.01 4.06,13.21 4.83,13.97 v5.08,13.97
  Bottom 0.254: v5.08,13.97 5.84,13.21 5.84,9.91 6.6,9.14 17.78,9.14 18.54,9.91 20.32,9.91 20.83,9.4 U$39.P$3
RXD
  Top 0.178: IC1.40 30.03,18.73 29.97,18.8 29.97,19.81 28.18,21.6 PIN_UART.P$2
TXD
  Top 0.178: IC1.41 29.75,18.38 29.56,18.57 29.56,19.6 28.47,20.69 27.45,20.69 27.29,20.85 PIN_UART.P$3
VDD_SDIO
  Top 0.178: IC1.26 35.18,20.29 C18.2
VIN
  Top 0.254: C3.2 LDO1.VIN 33.63,24.36 | FB2.1 33.63,24.4 33.63,24.36 | C14.2 33.91,23.5 33.63,23.77 33.63,24.36
VIN_PIN
  Top 0.254: PIN_PWR.P$2 38.37,22.23 37.21,22.23 36.45,22.99 36.45,24 36.07,24.38 FB2.2
WAKE_DECA  (via drill 0.25 pad 0.51)
  Top 0.254: LPS1.2 2.54,10.88 v2.54,13.97 | v15.49,9.8 21.69,9.8 22.1,9.4 U$39.P$2
  Bottom 0.254: v15.49,9.8 6.96,9.8 6.6,10.16 6.6,13.72 5.59,14.73 3.3,14.73 v2.54,13.97
XIN
  Top 0.152: IC1.45 28.41,16.98 28.08,16.65 28.08,16.29 27.92,16.13 27.05,16.13 26.95,16.23 C4.2
  Top 0.254: C4.2 26.29,16.64 26.07,16.85 26.07,17.33 XTAL1.1
XOUT
  Top 0.127: IC1.44 28,17.33 28,19.56 27.88,19.68 C5.2 27.53,19 XTAL1.3

### Text on the board
tPlace: MTCK | MTDI | MTDO | MTMS
bPlace: FSYNC | INT | SPI_MOSI | SPI_MISO | SPI_CS | SPI_CLK | SPI / (3.3V) | GND | GND | RX/IO3 | VIN | GND | TX/IO1 | 3V3 | IO26=R | BOOT | IO4=G | https://femto.io | LPS/WiFi/BT | ESP32 LPS | FemtoBeacon | IO5=B | MTMS/IO14 | FSYNC | MTDO/IO15 | MTDI/IO12 | MTCK/IO13 | IO35 | 3V3 | IO34 | GND | EN | LPS/IRQ | LPS/RST | LPS/WAKE | LPS/EXTON | 1.0.1